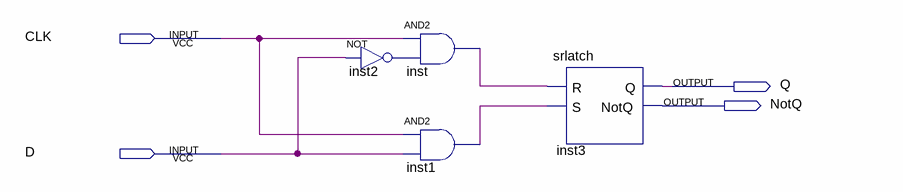
[diagram p0: schematic sheet]
// Quartus schematic latchd.bdf as structural Verilog: 4 symbols, 4 pins
module latchd (
  input  CLK,
  input  D,
  output Q,
  output NotQ
);

  wire inst1_out, inst2_out, inst_out;

  not inst2 (inst2_out, D);
  and inst (inst_out, CLK, inst2_out);
  and inst1 (inst1_out, CLK, D);
  srlatch inst3 (.R(inst_out), .S(inst1_out), .Q(Q), .NotQ(NotQ));
endmodule
